# Altium schematic sheet Air sensor, SD card.SchDoc
size A4; Organization: Altium Limited; Address1: L3, 12a Rodborough Rd; Address2: Frenchs Forest; Address3: NSW; Address4: Australia 2086
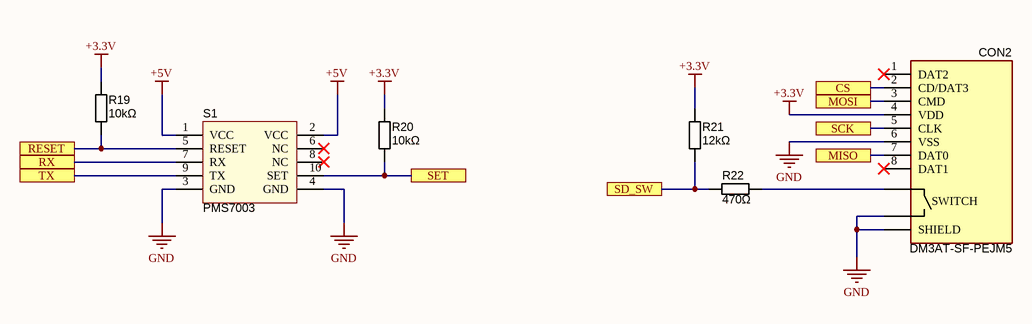
[diagram p0: Air sensor, SD card.SchDoc]

## Parts
CON2  DM3AT-SF-PEJM5  [DM3ATSFPEJM5]
R19  value 10kΩ  [RESC1608N]  (hidden comment: Thick Film)
R20  value 10kΩ  [RESC1608N]  (hidden comment: Thick Film)
R21  value 12kΩ  [RESC1608N]  (hidden comment: Thick Film)
R22  value 470Ω  [RESC1608N]  (hidden comment: Thick Film)
S1  PMS7003  [PMS7003]

## Ports
CS, MISO, MOSI, RESET, RX, SCK, SD_SW, SET, TX

## Nets
+3.3V: CON2.4(VDD) R19.2 R20.2 R21.2
+5V: S1.1(VCC) S1.2(VCC)
GND: CON2.6(VSS) CON2.10(SW_2) CON2.GND(SHIELD) S1.3(GND) S1.4(GND)
CS: CON2.2(CD/DAT3) ; port CS
MISO: CON2.7(DAT0) ; port MISO
MOSI: CON2.3(CMD) ; port MOSI
RESET: R19.1 S1.5(RESET) ; port RESET
RX: S1.7(RX) ; port RX
SCK: CON2.5(CLK) ; port SCK
SD_SW: R21.1 R22.2 ; port SD_SW
SET: R20.1 S1.10(SET) ; port SET
TX: S1.9(TX) ; port TX
NetCON2_9: CON2.9(SW_1) R22.1

Not connected (* = marked no-connect by the designer): CON2 1(DAT2)* 8(DAT1)*; S1 6(NC)* 8(NC)*

## Notes on the sheet
- Title
- Size:
- Date:
- A4
- Number:
- Time:
- Revision:
- Sheet
- of
- File:
- (in symbol DM3AT-SF-PEJM5) SWITCH

## Library data of the parts
CON2 = DM3AT-SF-PEJM5: Connector; Manufacturer_Name: HRS(Hirose); Datasheet Link: https://datasheet.lcsc.com/szlcsc/Hirose-HRS-DM3AT-SF-PEJM5_C114218.pdf; Height: 1.83mm; Manufacturer_Part_Number: DM3AT-SF-PEJM5
R19-R22 = RES_1K5_0603_5%: Resistor SMD chip 1.5k Ohm 0.1W 5% 0603; Manufacturer 1: Yageo; Manufacturer Part Number 1: RC0603JR-071K5L; Ratings: 1/10 W; Package / Case: 0603 (1608 metric); Tolerance: ±5%; Material: thick film; Supplier 1: Digi-Key; Supplier Part Number 1: 311-1.5KGRCT-ND